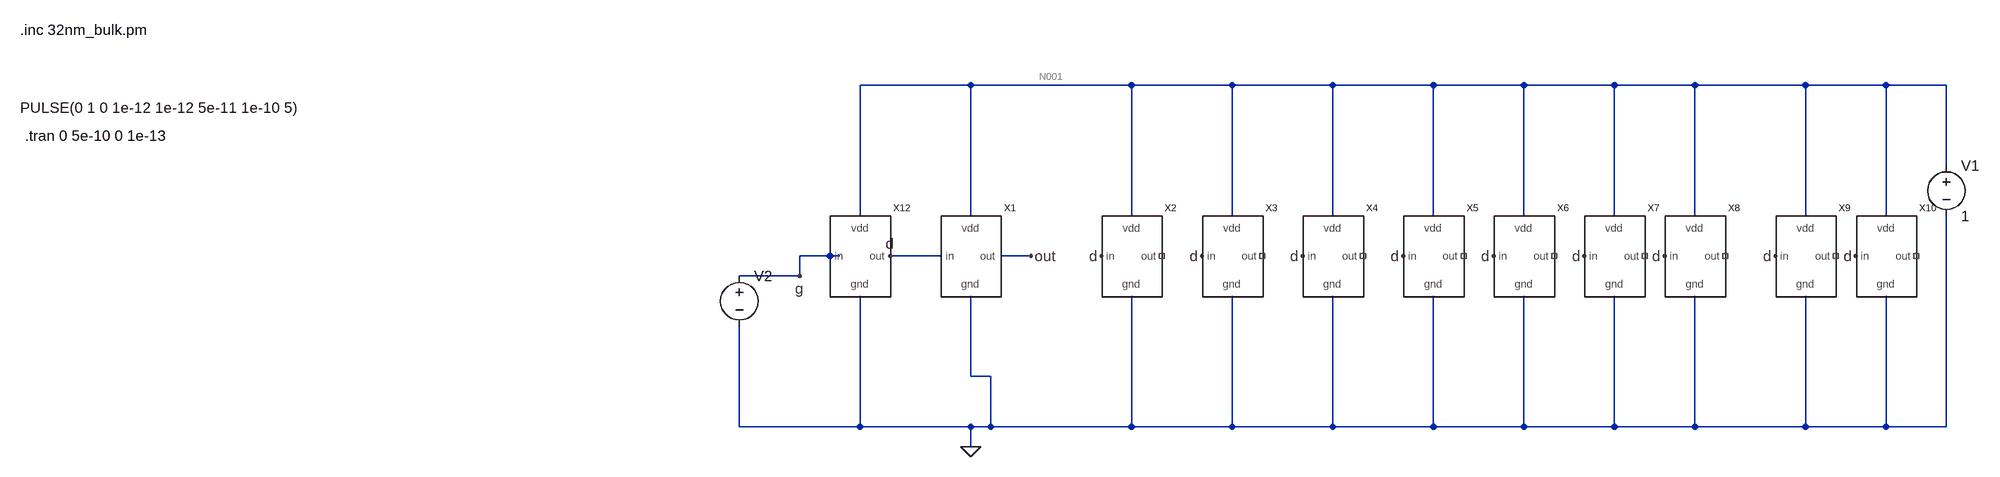
[diagram p0: schematic invertor_pulse.asc]
invertor_pulse.asc, the LTspice schematic file:
Version 4
SHEET 1 1984 680
WIRE 368 -80 192 -80
WIRE 624 -80 368 -80
WIRE 784 -80 624 -80
WIRE 944 -80 784 -80
WIRE 1104 -80 944 -80
WIRE 1248 -80 1104 -80
WIRE 1392 -80 1248 -80
WIRE 1520 -80 1392 -80
WIRE 1696 -80 1520 -80
WIRE 1824 -80 1696 -80
WIRE 1920 -80 1824 -80
WIRE 1920 48 1920 -80
WIRE 192 128 192 -80
WIRE 368 128 368 -80
WIRE 624 128 624 -80
WIRE 784 128 784 -80
WIRE 944 128 944 -80
WIRE 1104 128 1104 -80
WIRE 1248 128 1248 -80
WIRE 1392 128 1392 -80
WIRE 1520 128 1520 -80
WIRE 1696 128 1696 -80
WIRE 1824 128 1824 -80
WIRE 144 192 96 192
WIRE 160 192 144 192
WIRE 320 192 240 192
WIRE 464 192 416 192
WIRE 96 224 96 192
WIRE 96 224 0 224
WIRE 368 384 368 256
WIRE 400 384 368 384
WIRE 0 464 0 304
WIRE 192 464 192 256
WIRE 192 464 0 464
WIRE 368 464 192 464
WIRE 400 464 400 384
WIRE 400 464 368 464
WIRE 624 464 624 256
WIRE 624 464 400 464
WIRE 784 464 784 256
WIRE 784 464 624 464
WIRE 944 464 944 256
WIRE 944 464 784 464
WIRE 1104 464 1104 256
WIRE 1104 464 944 464
WIRE 1248 464 1248 256
WIRE 1248 464 1104 464
WIRE 1392 464 1392 256
WIRE 1392 464 1248 464
WIRE 1520 464 1520 256
WIRE 1520 464 1392 464
WIRE 1696 464 1696 256
WIRE 1696 464 1520 464
WIRE 1824 464 1824 256
WIRE 1824 464 1696 464
WIRE 1920 464 1920 128
WIRE 1920 464 1824 464
WIRE 368 496 368 464
FLAG 368 496 0
FLAG 464 192 out
FLAG 576 192 d
FLAG 736 192 d
FLAG 896 192 d
FLAG 1056 192 d
FLAG 1200 192 d
FLAG 1344 192 d
FLAG 1472 192 d
FLAG 1648 192 d
FLAG 1776 192 d
FLAG 240 192 d
FLAG 96 224 g
SYMBOL voltage 1920 32 R0
WINDOW 123 0 0 Left 0
WINDOW 39 0 0 Left 0
SYMATTR InstName V1
SYMATTR Value 1
SYMBOL voltage 0 208 R0
WINDOW 123 0 0 Left 0
WINDOW 39 0 0 Left 0
WINDOW 3 -1144 -252 Left 2
SYMATTR Value PULSE(0 1 0 1e-12 1e-12 5e-11 1e-10 5)
SYMATTR InstName V2
SYMBOL invert 368 192 R0
SYMATTR InstName X1
SYMBOL invert 624 192 R0
SYMATTR InstName X2
SYMBOL invert 784 192 R0
SYMATTR InstName X3
SYMBOL invert 944 192 R0
SYMATTR InstName X4
SYMBOL invert 1104 192 R0
SYMATTR InstName X5
SYMBOL invert 1248 192 R0
SYMATTR InstName X6
SYMBOL invert 1392 192 R0
SYMATTR InstName X7
SYMBOL invert 1520 192 R0
SYMATTR InstName X8
SYMBOL invert 1696 192 R0
SYMATTR InstName X9
SYMBOL invert 1824 192 R0
SYMATTR InstName X10
SYMBOL invert 192 192 R0
SYMATTR InstName X12
TEXT -1136 0 Left 2 !.tran 0 5e-10 0 1e-13
TEXT -1144 -168 Left 2 !.inc 32nm_bulk.pm

The netlist it stands for:
* invertor_pulse.asc
V1 N001 0 1
V2 g 0 PULSE(0 1 0 1e-12 1e-12 5e-11 1e-10 5)
XX1 d N001 0 out invert  ; pins in vdd gnd out
XX2 d N001 0 NC_01 invert  ; pins in vdd gnd out
XX3 d N001 0 NC_02 invert  ; pins in vdd gnd out
XX4 d N001 0 NC_03 invert  ; pins in vdd gnd out
XX5 d N001 0 NC_04 invert  ; pins in vdd gnd out
XX6 d N001 0 NC_05 invert  ; pins in vdd gnd out
XX7 d N001 0 NC_06 invert  ; pins in vdd gnd out
XX8 d N001 0 NC_07 invert  ; pins in vdd gnd out
XX9 d N001 0 NC_08 invert  ; pins in vdd gnd out
XX10 d N001 0 NC_09 invert  ; pins in vdd gnd out
XX12 g N001 0 d invert  ; pins in vdd gnd out
.tran 0 5e-10 0 1e-13
.inc 32nm_bulk.pm
.backanno
.end

* Results of the author's LTspice run, read from the files saved beside the schematic
* Operating Point, zero values left out:
*   V(n001) = 1 V
*   V(d) = 999.8 mV
*   V(out) = 153.6 µV
*   I(V2) = 1.897 nA
*   I(V1) = -2.431 µA
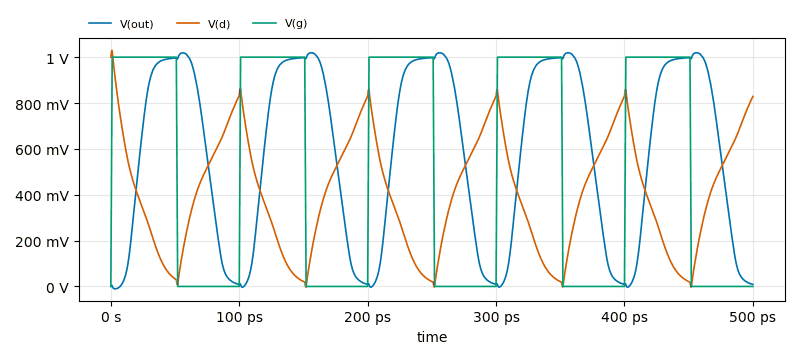
[diagram p1: Transient Analysis of invertor_pulse.asc, plotted from the saved traces]
* Transient Analysis, 1 run:
*   V(out): min -10.31 mV, max 1.019 V, average 582.8 mV, rms 706.9 mV, last 8.937 mV
*   V(d): min -2.971 mV, max 1.03 V, average 405.1 mV, rms 477.5 mV, last 828.8 mV
*   V(g): min 0 V, max 1 V, average 510 mV, rms 711.8 mV, last 0 V